# EAGLE design schema (EAGLE 9.5.2)
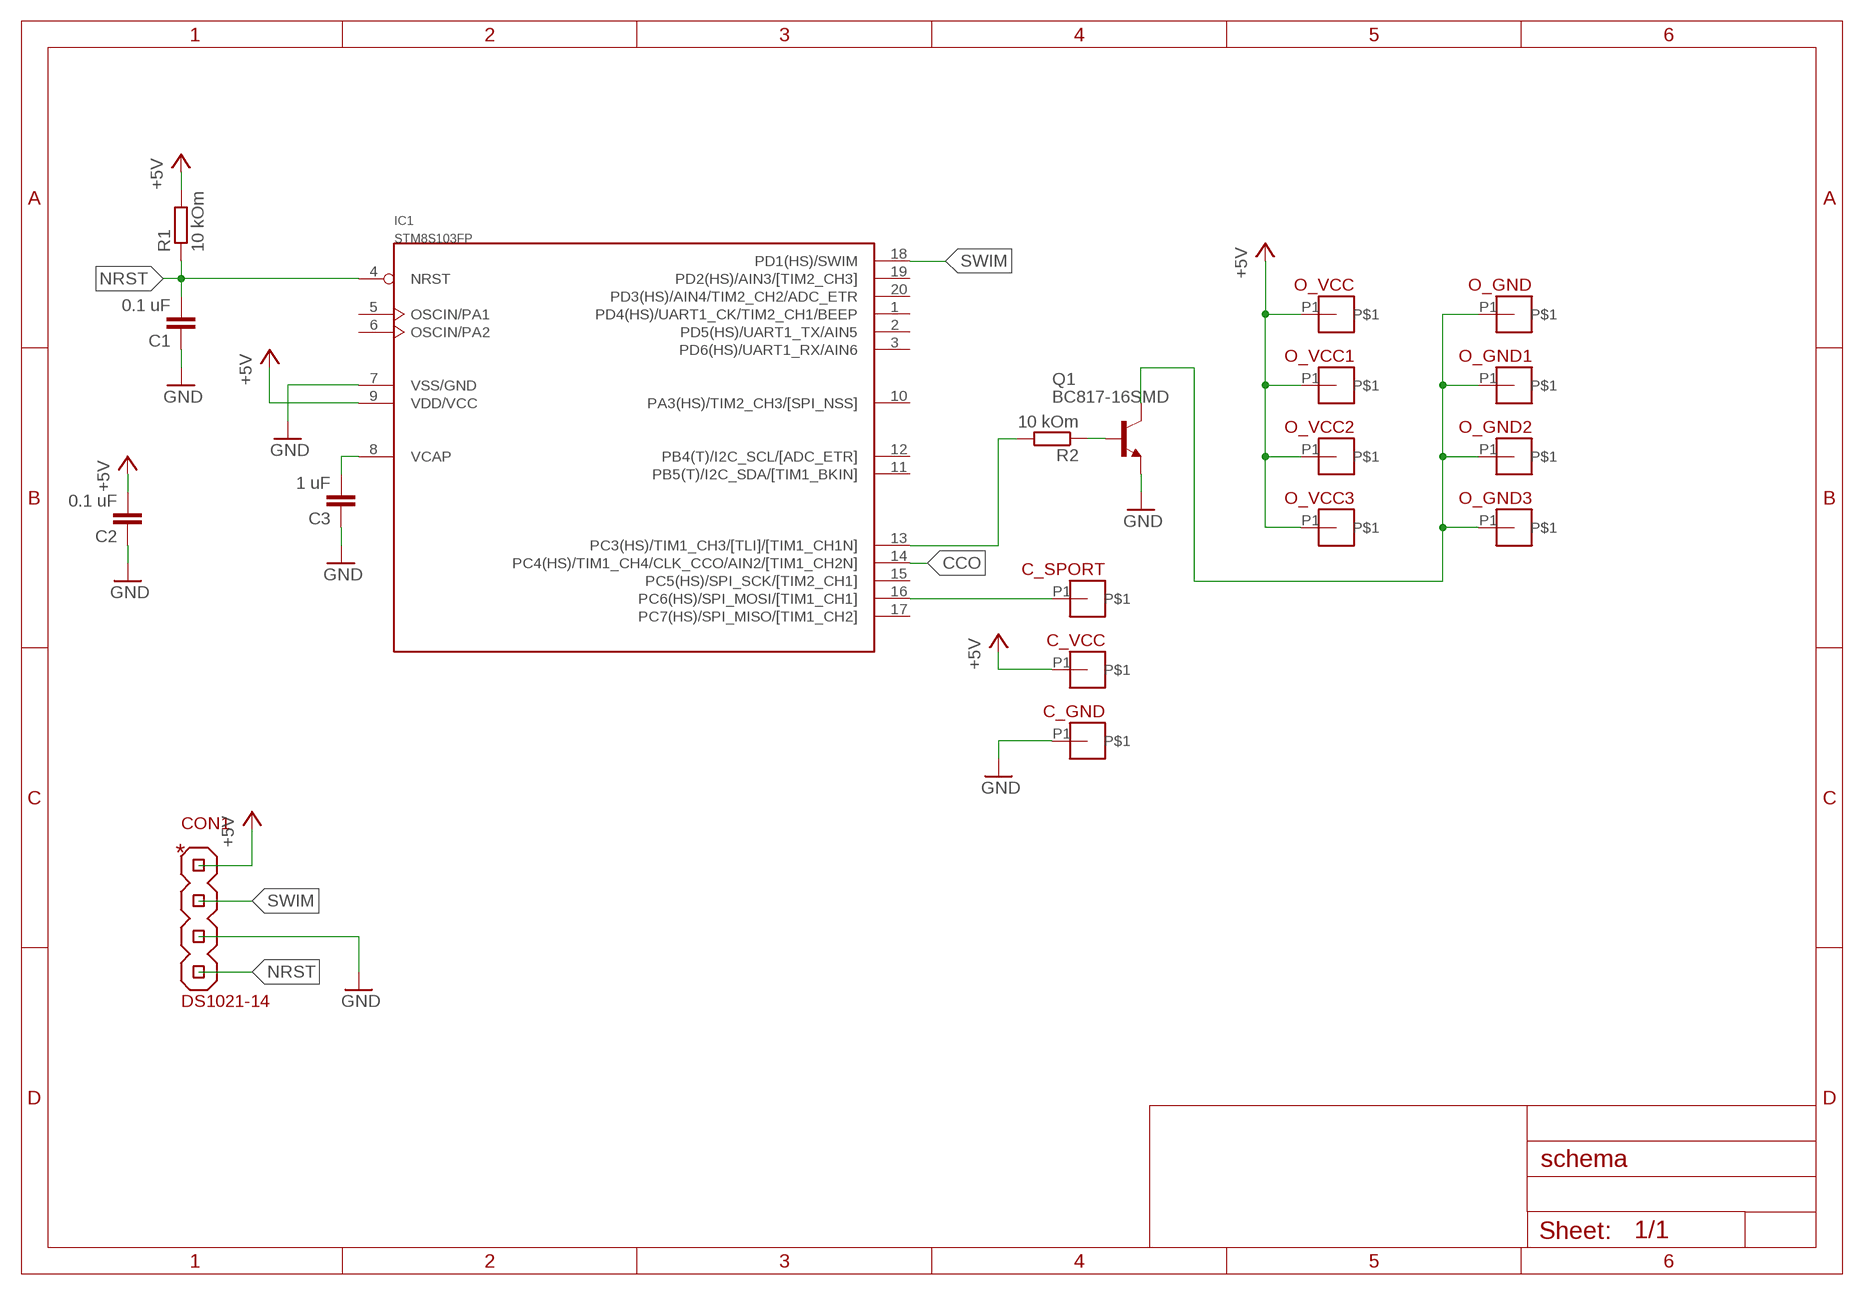
[diagram p0: schematic, sheet 1]

## Parts
C1  0.1 uF  C-EUC0603  [C0603]
C2  0.1 uF  C-EUC0603  [C0603]
C3  1 uF  C-EUC0603  [C0603]
C_GND  PAD1_0.8  [PAD1_0.8]
C_SPORT  PAD1_0.8  [PAD1_0.8]
C_VCC  PAD1_0.8  [PAD1_0.8]
CON1  DS1021-14  [DS1021-1*4]
IC1  STM8S103FP  [TSSOP20]
O_GND  PAD1_0.8  [PAD1_0.8]
O_GND1  PAD1_0.8  [PAD1_0.8]
O_GND2  PAD1_0.8  [PAD1_0.8]
O_GND3  PAD1_0.8  [PAD1_0.8]
O_VCC  PAD1_0.8  [PAD1_0.8]
O_VCC1  PAD1_0.8  [PAD1_0.8]
O_VCC2  PAD1_0.8  [PAD1_0.8]
O_VCC3  PAD1_0.8  [PAD1_0.8]
Q1  BC817-16SMD  [SOT23-BEC]
R1  10 kOm  R-EU_R0603  [R0603]
R2  10 kOm  R-EU_R0603  [R0603]

## Nets
+5V: C2.2 C_VCC.P1 CON1.P1 IC1.9(VDD/VCC) O_VCC1.P1 O_VCC2.P1 O_VCC3.P1 O_VCC.P1 R1.2
CCO: IC1.14(PC4(HS)/TIM1_CH4/CLK_CCO/AIN2/[TIM1_CH2N])
GND: C1.1 C2.1 C3.1 C_GND.P1 CON1.P3 IC1.7(VSS/GND) Q1.E
N$1: C_SPORT.P1 IC1.16(PC6(HS)/SPI_MOSI/[TIM1_CH1])
N$2: C3.2 IC1.8(VCAP)
N$4: O_GND1.P1 O_GND2.P1 O_GND3.P1 O_GND.P1 Q1.C
N$5: IC1.13(PC3(HS)/TIM1_CH3/[TLI]/[TIM1_CH1N]) R2.2
N$6: Q1.B R2.1
NRST: C1.2 CON1.P4 IC1.4(NRST) R1.1
SWIM: CON1.P2 IC1.18(PD1(HS)/SWIM)
Unconnected: IC1.1(PD4(HS)/UART1_CK/TIM2_CH1/BEEP) IC1.2(PD5(HS)/UART1_TX/AIN5) IC1.3(PD6(HS)/UART1_RX/AIN6) IC1.5(OSCIN/PA1) IC1.6(OSCIN/PA2) IC1.10(PA3(HS)/TIM2_CH3/[SPI_NSS]) IC1.11(PB5(T)/I2C_SDA/[TIM1_BKIN]) IC1.12(PB4(T)/I2C_SCL/[ADC_ETR]) IC1.15(PC5(HS)/SPI_SCK/[TIM2_CH1]) IC1.17(PC7(HS)/SPI_MISO/[TIM1_CH2]) IC1.19(PD2(HS)/AIN3/[TIM2_CH3]) IC1.20(PD3(HS)/AIN4/TIM2_CH2/ADC_ETR)

## Library data of the parts
C1-C3 = rcl:C-EU: CAPACITOR, European symbol; SPICEPREFIX: C
C_GND C_SPORT C_VCC O_GND O_GND1-O_GND3 O_VCC O_VCC1-O_VCC3 = Конекторы:PAD1: Одиночный разьем
CON1 = Конекторы:DS1021-1*4: DS1021-1*4; PLD; Штырьки
IC1 = stm8s103:STM8S103F*: STM8S103F*
Q1 = transistor-npn:BC817*: NPN Transistor
R1 R2 = rcl:R-EU_: RESISTOR, European symbol; SPICEPREFIX: R

## Board
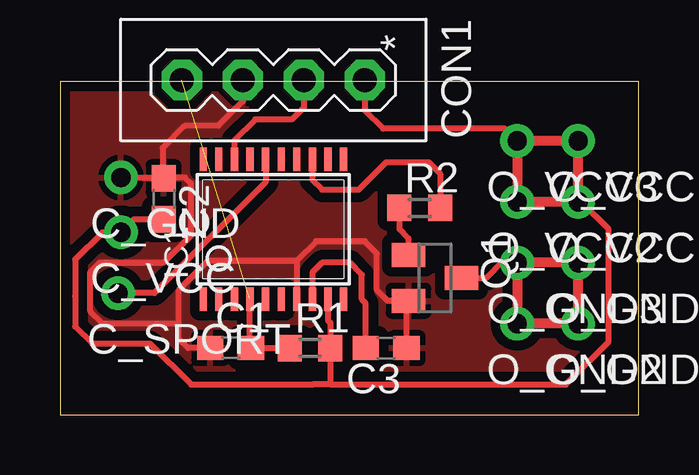
[diagram p1: board, top side]

Size 24.11 x 13.89 mm. Coordinates in mm from the lower left corner, seen from the top.
Outline: 0,0 24.11,0 24.11,13.89 0,13.89 0,0
Copper layers (1*16): Top 0.035mm / dielectric 1.5mm / Bottom 0.035mm
Design rules "default *": minimum track width 6mil, minimum drill 0.35mm, track to track 6mil, track to pad 6mil, pad to pad 6mil, via to via 6mil, smd to smd 6mil, copper to edge 10mil, drill to drill 6mil, minimum pad ring 10mil, minimum via ring 8mil, stop-mask expansion 4mil, vias tented up to drill 0mil, thermal gap 10mil

### Footprints (pad centres in the part's own frame; a part is rotated, then mirrored left to right if it is on the bottom)
C0603 = smd 1.1 x 1: 1 -0.85,0; 2 0.85,0
PAD1_0.8 = drill 0.8 pad 1.4: P1 0,0
DS1021-1*4 = drill 1 pad 1.676 octagon: P1 2.54,-2.54; P2 2.54,-5.08; P3 2.54,-7.62; P4 2.54,-10.16
TSSOP20 = smd 0.305 x 0.991: 1 -2.925,-2.918; 2 -2.275,-2.918; 3 -1.625,-2.918; 4 -0.975,-2.918; 5 -0.325,-2.918; 6 0.325,-2.918; 7 0.975,-2.918; 8 1.625,-2.918; 9 2.275,-2.918; 10 2.925,-2.918; 11 2.925,2.918; 12 2.275,2.918; 13 1.625,2.918; 14 0.975,2.918; 15 0.325,2.918; 16 -0.325,2.918; 17 -0.975,2.918; 18 -1.625,2.918; 19 -2.275,2.918; 20 -2.925,2.918
SOT23-BEC = smd 1 x 1.4: B -0.95,-1.1; C 0,1.1; E 0.95,-1.1
R0603 = smd 1 x 1.1: 1 -0.85,0; 2 0.85,0

### Placement (x,y rotation side)
C1  7.11,2.79 0 top
C2  4.32,9.02 270 top
C3  13.59,2.79 180 top
C_GND  2.54,9.91 0 top
C_SPORT  2.41,5.08 0 top
C_VCC  2.54,7.62 0 top
CON1  15.24,16.51 270 top
IC1  8.89,7.75 0 top
O_GND  21.59,6.35 0 top
O_GND1  21.59,3.81 0 top
O_GND2  19.05,3.81 0 top
O_GND3  19.05,6.35 0 top
O_VCC  21.59,11.43 0 top
O_VCC1  21.59,8.89 0 top
O_VCC2  19.05,8.89 0 top
O_VCC3  19.05,11.43 0 top
Q1  15.62,5.71 270 top
R1  10.41,2.79 0 top
R2  14.99,8.64 0 top

### Tracks (layer width: path | path; a pad name or v marks a point on that pad's centre or on a via)
+5V
  Top 0.254: C2.2 3.09,8.17 C_VCC.P1 1.78,7.62 0.64,6.48 0.64,4.95 0.64,3.68 1.33,2.98 3.75,2.98 5.46,1.27 10.54,1.27 11.26,1.27 | O_VCC1.P1 21.72,8.89 22.86,7.75 22.86,3.05 21.08,1.27 11.26,1.27 | 11.39,2.92 R1.2 | IC1.9 11.16,3.95 11.26,3.85 R1.2 | O_VCC3.P1 18.54,11.94 13.46,11.94 12.7,12.7 CON1.P1 | R1.2 11.26,1.27
  Top 0.406: O_VCC1.P1 O_VCC2.P1 O_VCC3.P1 O_VCC.P1 O_VCC1.P1
GND
  Top 0.254: 4.28,9.91 C_GND.P1 2.29,9.91 | 9.87,6.44 IC1.7 | 9.87,6.44 10.67,7.24 12.7,7.24 13.21,6.73 13.21,5.21 13.65,4.76 Q1.E 14.44,4.68 C3.1 | CON1.P3 7.62,13.08 6.6,12.06 5.21,12.06 4.28,11.14 4.28,9.91 | C1.1 5.33,2.79 4.95,3.17 4.95,3.81 | 4.95,3.81 4.95,5.21 6.18,6.44 9.87,6.44 | 4.95,3.81 1.78,3.81 1.27,4.32 1.27,5.97 1.65,6.35 4.32,6.35 5.46,7.49 5.46,9.27 5.46,9.65 5.21,9.91 4.28,9.91
  Top 0.406: 4.28,9.91 C2.1
  pour Top (isolate 0.406): 0,13.97 24.13,13.97 24.13,0 0,0
N$1
  Top 0.254: IC1.16 8.56,9.71 3.94,5.08 C_SPORT.P1
N$2
  Top 0.254: C3.2 12.74,4.66 12.57,4.83 12.57,5.84 12.06,6.35 10.92,6.35 10.52,5.94 IC1.8
N$4
  Top 0.254: Q1.C 17.78,5.71 18.41,6.35 O_GND3.P1
  Top 0.406: O_GND3.P1 O_GND2.P1 O_GND1.P1 O_GND.P1 O_GND3.P1
N$5
  Top 0.254: IC1.13 10.52,9.8 10.92,9.4 12.45,9.4 13.59,10.54 15.37,10.54 15.84,10.07 R2.2
N$6
  Top 0.254: R2.1 14.14,7.75 14.52,7.37 Q1.B
NRST  (1 unrouted)
  Top 0.254: IC1.4 7.92,2.84 C1.2 R1.1
SWIM
  Top 0.254: CON1.P2 10.16,12.83 9.65,12.32 8.13,12.32 7.26,11.46 IC1.18